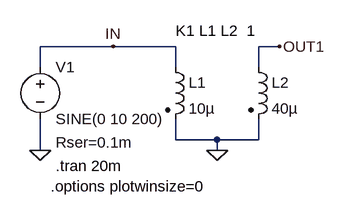
[diagram p0: schematic Fig_2-116_Trans_K_2.asc]
Fig_2-116_Trans_K_2.asc, the LTspice schematic file:
Version 4
SHEET 1 880 680
WIRE 128 96 16 96
WIRE 224 96 128 96
WIRE 384 96 352 96
WIRE 16 128 16 96
WIRE 224 128 224 96
WIRE 352 128 352 96
WIRE 224 240 224 208
WIRE 288 240 224 240
WIRE 352 240 352 208
WIRE 352 240 288 240
WIRE 16 256 16 208
WIRE 288 256 288 240
FLAG 288 256 0
FLAG 16 256 0
FLAG 384 96 OUT1
FLAG 128 96 IN
SYMBOL ind2 208 112 R0
SYMATTR InstName L1
SYMATTR Value 10µ
SYMATTR Type ind
SYMBOL ind2 336 112 R0
SYMATTR InstName L2
SYMATTR Value 40µ
SYMATTR Type ind
SYMBOL voltage 16 112 R0
WINDOW 123 0 0 Left 2
WINDOW 39 24 132 Left 2
SYMATTR SpiceLine Rser=0.1m
SYMATTR InstName V1
SYMATTR Value SINE(0 10 200)
TEXT 40 280 Left 2 !.tran 20m
TEXT 224 72 Left 2 !K1 L1 L2  1
TEXT 32 312 Left 2 !.options plotwinsize=0

The netlist it stands for:
* Fig_2-116_Trans_K_2.asc
L1 IN 0 10µ
L2 OUT1 0 40µ
V1 IN 0 SINE(0 10 200) Rser=0.1m
.tran 20m
K1 L1 L2  1
.options plotwinsize=0
.backanno
.end